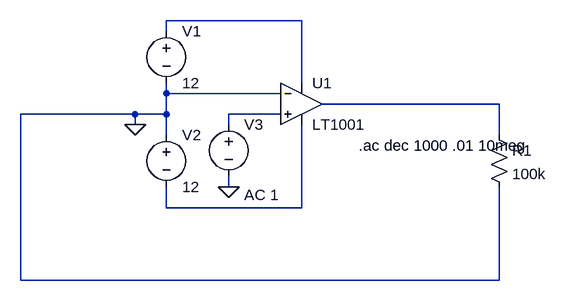
[diagram p0: schematic LT1001.asc]
LT1001.asc, the LTspice schematic file:
Version 4
SHEET 1 880 680
WIRE 176 64 -32 64
WIRE -32 80 -32 64
WIRE 176 160 176 64
WIRE -32 176 -32 160
WIRE 144 176 -32 176
WIRE 480 192 208 192
WIRE -80 208 -256 208
WIRE -32 208 -32 176
WIRE -32 208 -80 208
WIRE 144 208 64 208
WIRE -80 224 -80 208
WIRE 64 224 64 208
WIRE -32 240 -32 208
WIRE 480 240 480 192
WIRE 64 320 64 304
WIRE -32 352 -32 320
WIRE 176 352 176 224
WIRE 176 352 -32 352
WIRE -256 464 -256 208
WIRE 480 464 480 320
WIRE 480 464 -256 464
FLAG -80 224 0
FLAG 64 320 0
SYMBOL Opamps\\LT1001 176 128 R0
SYMATTR InstName U1
SYMBOL voltage -32 64 R0
WINDOW 123 0 0 Left 2
WINDOW 39 0 0 Left 2
SYMATTR InstName V1
SYMATTR Value 12
SYMBOL voltage -32 224 R0
WINDOW 123 0 0 Left 2
WINDOW 39 0 0 Left 2
SYMATTR InstName V2
SYMATTR Value 12
SYMBOL voltage 64 208 R0
WINDOW 123 24 124 Left 2
WINDOW 39 0 0 Left 2
SYMATTR InstName V3
SYMATTR Value ""
SYMATTR Value2 AC 1
SYMBOL res 464 224 R0
SYMATTR InstName R1
SYMATTR Value 100k
TEXT 264 256 Left 2 !.ac dec 1000 .01 10meg

The netlist it stands for:
* LT1001.asc
XU1 N003 0 N001 N004 N002 LT1001  ; pins In+ In- V+ V- OUT
V1 N001 0 12
V2 0 N004 12
V3 N003 0 AC 1
R1 N002 0 100k
.ac dec 1000 .01 10meg
.lib LTC.lib
.backanno
.end